# Altium project Intf_PCB.PrjPcb
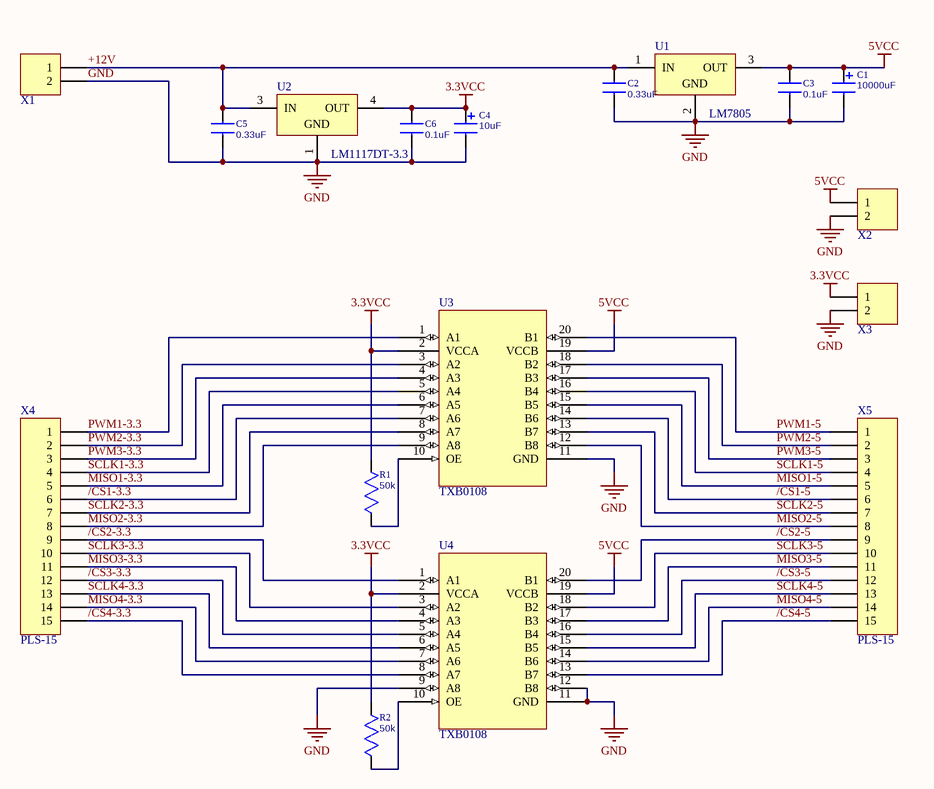
[diagram p0: Intf_PCB.SchDoc]
1 sheet, 17 parts. Net scope: global (net labels, ports and power ports of the same name join across sheets).
Board file: Intf_PCB.PcbDoc

## Sheet Intf_PCB.SchDoc
size A

### Parts
C1  10000uF  [CAP470X25V]
C2  0.33uF  [C_1206]
C3  0.1uF  [C_1206]
C4  10uF  [CAP470X25V]
C5  0.33uF  [C_1206]
C6  0.1uF  [C_1206]
R1  50k  [R_1206]
R2  50k  [R_1206]
U1  LM7805  [T03B]
U2  LM1117DT-3.3  [TD03B_M]
U3  TXB0108  [TSOP65P640X120-20N]
U4  TXB0108  [TSOP65P640X120-20N]
X1  PWL-2  [15EDGVC]  (value not drawn)
X2  PWL-2  [15EDGVC]  (value not drawn)
X3  PWL-2  [15EDGVC]  (value not drawn)
X4  PLS-15  [PLS-15-3D]
X5  PLS-15  [PLS-15-3D]

### Nets
3.3VCC: C4.1 C6.1 R1.1 R2.1 U2.4(OUT) U3.2(VCCA) U4.2(VCCA) X3.1
5VCC: C1.1 C3.1 U1.3(OUT) U3.19(VCCB) U4.19(VCCB) X2.1
GND: C1.2 C2.2 C3.2 C4.2 C5.2 C6.2 U1.2(GND) U2.1(GND) U3.11(GND) U4.9(A8) U4.11(GND) U4.12(B8) X1.2 X2.2 X3.2
+12V: C2.1 C5.1 U1.1(IN) U2.3(IN) X1.1
/CS1-3.3: U3.7(A6) X4.6
/CS1-5: U3.14(B6) X5.6
/CS2-3.3: U4.1(A1) X4.9
/CS2-5: U4.20(B1) X5.9
/CS3-3.3: U4.5(A4) X4.12
/CS3-5: U4.16(B4) X5.12
/CS4-3.3: U4.8(A7) X4.15
/CS4-5: U4.13(B7) X5.15
MISO1-3.3: U3.6(A5) X4.5
MISO1-5: U3.15(B5) X5.5
MISO2-3.3: U3.9(A8) X4.8
MISO2-5: U3.12(B8) X5.8
MISO3-3.3: U4.4(A3) X4.11
MISO3-5: U4.17(B3) X5.11
MISO4-3.3: U4.7(A6) X4.14
MISO4-5: U4.14(B6) X5.14
PWM1-3.3: U3.1(A1) X4.1
PWM1-5: U3.20(B1) X5.1
PWM2-3.3: U3.3(A2) X4.2
PWM2-5: U3.18(B2) X5.2
PWM3-3.3: U3.4(A3) X4.3
PWM3-5: U3.17(B3) X5.3
SCLK1-3.3: U3.5(A4) X4.4
SCLK1-5: U3.16(B4) X5.4
SCLK2-3.3: U3.8(A7) X4.7
SCLK2-5: U3.13(B7) X5.7
SCLK3-3.3: U4.3(A2) X4.10
SCLK3-5: U4.18(B2) X5.10
SCLK4-3.3: U4.6(A5) X4.13
SCLK4-5: U4.15(B5) X5.13
NetR1_2: R1.2 U3.10(OE)
NetR2_2: R2.2 U4.10(OE)

### Library data of the parts
C1 C4 = C_10_12_5mm: Capacitor
  C1: Value: 10000uF
  C4: Value: 10uF
C2 C3 C5 C6 = C1206: Capacitor
  C2 C5: Value: 0.33uF
  C3 C6: Value: 0.1uF
R1 R2 = R1206: Resistor; Value: 50k
U1 = LM78M05CT: 3-Terminal Positive Voltage Regulators; Manufacturer: National Semiconductor; CompType: LDO IC; PackageTopMarking: NSUZXYTTE#*LM341T-5.0*LM78M05CT; Published: 4-Dec-2008; DatasheetVersion: Aug-2005; PackageVersion: revL, Jan-1992; PackageReference: T03B; Publisher: Altium Limited; PackageDescription: TO-220, Molded, 3 Lead, Straight; PartNumber: LM78M05CT; RoHS: O; PinCount: 3; DigiKeyPartNumber: LM78M05CT-ND; ComponentLink1Description: LM78M05 Datasheet; ComponentLink1URL: http://www.national.com/ds/LM/LM78M05.pdf; ComponentLink2Description: LM78M05 Web Page; ComponentLink2URL: http://www.national.com/pf/LM/LM78M05.html; ComponentLink3Description: T03B Package Page; ComponentLink3URL: http://www.national.com/packaging/folders/t03b.html
U2 = LM1117DT-3.3: 800mA Low-Dropout Linear Regulator; Manufacturer: National Semiconductor; CompType: LDO IC; PackageTopMarking: NSUZXYTT*LM1117*DT-3.3; PowerWise: N; Published: 4-Dec-2008; DatasheetVersion: Apr-2006; PackageVersion: revC, Apr-2003; PackageReference: TD03B; Publisher: Altium Limited; PackageDescription: TO252, Molded, Jedec, 6.8 x 6.10 x 2.30mm Body, 3 Lead, 2.28mm Pitch, Surface Mount; PartNumber: LM1117DT-3.3; RoHS: O; PinCount: 3; DigiKeyPartNumber: LM1117DT-3.3-ND; Code_JEDEC: TO-252-AA; ComponentLink1Description: LM1117 Datasheet; ComponentLink1URL: http://www.national.com/ds/LM/LM1117.pdf; ComponentLink2Description: LM1117 Web Page; ComponentLink2URL: http://www.national.com/pf/LM/LM1117.html; ComponentLink3Description: TD03B Package Page; ComponentLink3URL: http://www.national.com/packaging/folders/td03b.html
X1-X3 = PWL-2: Header, 2-Pin; LatestRevisionDate: 17-Jul-2002; LatestRevisionNote: Re-released for DXP Platform.; Publisher: Altium Limited
X4 X5 = PLS-15: Header, 15-Pin; LatestRevisionDate: 17-Jul-2002; LatestRevisionNote: Re-released for DXP Platform.; Publisher: Altium Limited